# EAGLE design BLDC&PMSM (EAGLE 7.6.0)
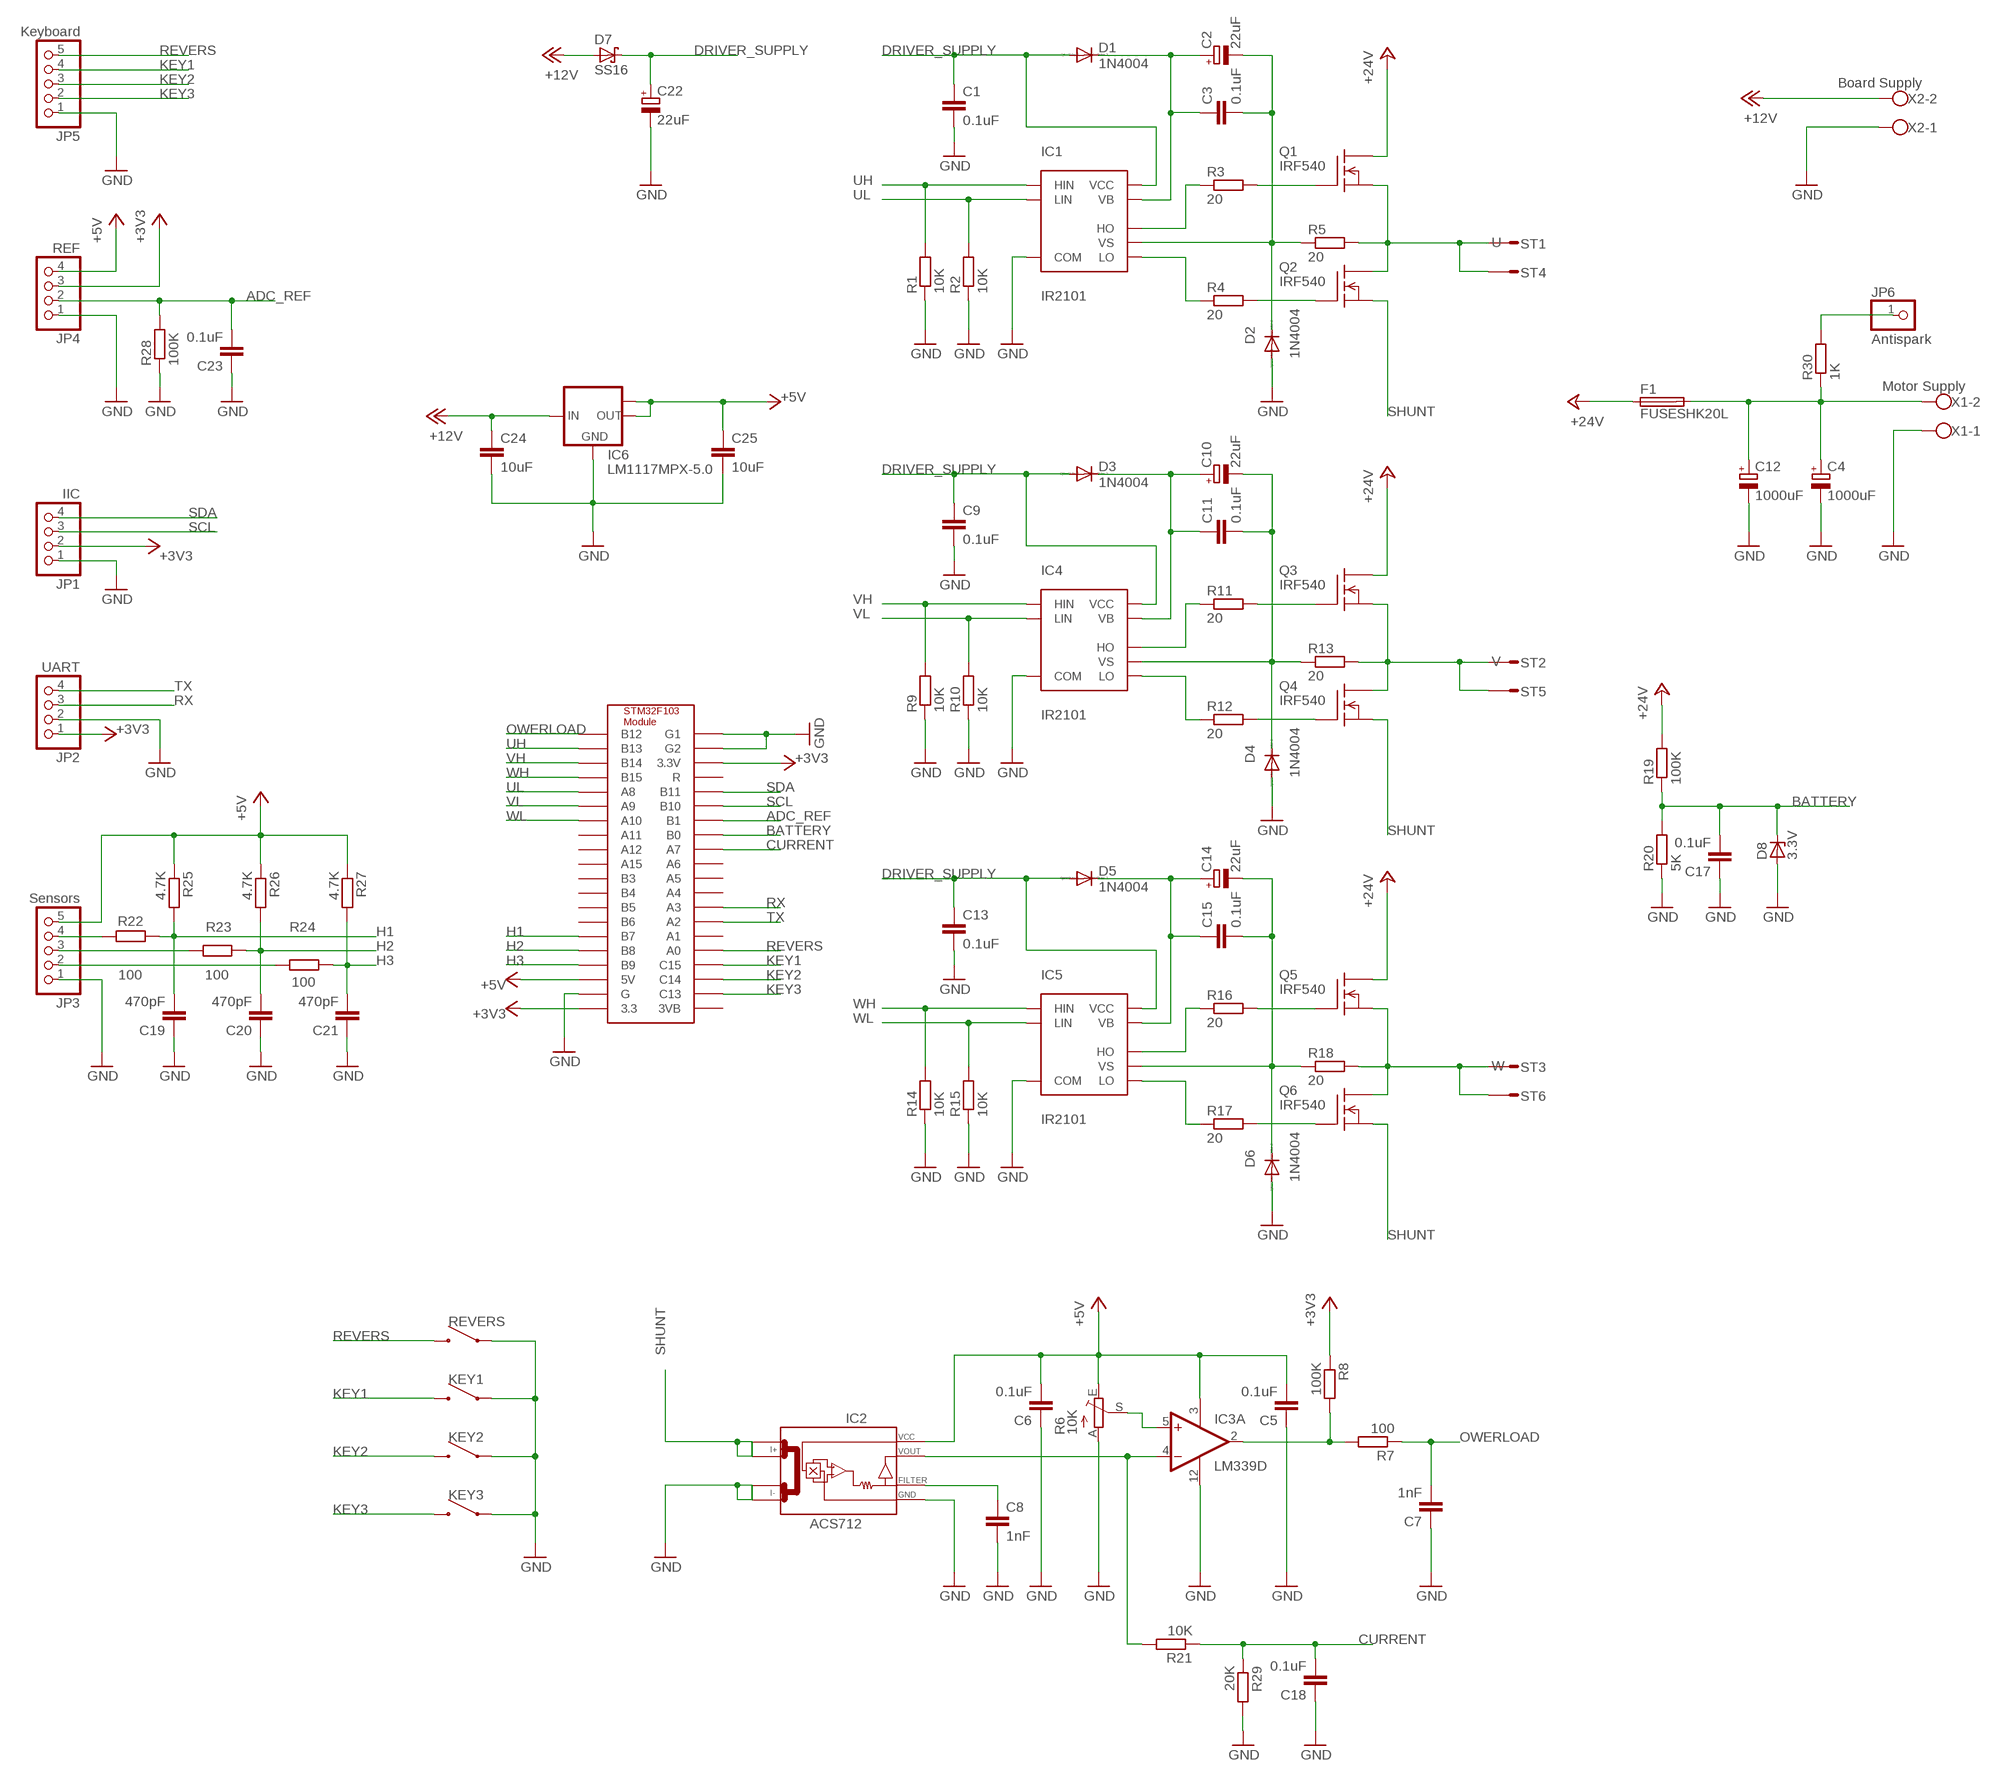
[diagram p0: schematic, sheet 1]

## Parts
C1  0.1uF  C-EUC0805K  [C0805K]
C2  22uF  CPOL-EUE2-5  [E2-5]
C3  0.1uF  C-EUC0805K  [C0805K]
C4  1000uF  CPOL-EUE5-13  [E5-13]
C5  0.1uF  C-EUC0805K  [C0805K]
C6  0.1uF  C-EUC0805K  [C0805K]
C7  1nF  C-EUC0805K  [C0805K]
C8  1nF  C-EUC0805K  [C0805K]
C9  0.1uF  C-EUC0805K  [C0805K]
C10  22uF  CPOL-EUE2-5  [E2-5]
C11  0.1uF  C-EUC0805K  [C0805K]
C12  1000uF  CPOL-EUE5-13  [E5-13]
C13  0.1uF  C-EUC0805K  [C0805K]
C14  22uF  CPOL-EUE2-5  [E2-5]
C15  0.1uF  C-EUC0805K  [C0805K]
C17  0.1uF  C-EUC0805K  [C0805K]
C18  0.1uF  C-EUC0805K  [C0805K]
C19  470pF  C-EUC0805K  [C0805K]
C20  470pF  C-EUC0805K  [C0805K]
C21  470pF  C-EUC0805K  [C0805K]
C22  22uF  CPOL-EUE2-5  [E2-5]
C23  0.1uF  C-EUC0805K  [C0805K]
C24  10uF  C-EUC0805K  [C0805K]
C25  10uF  C-EUC1206K  [C1206K]
D1  1N4004  [DO41-10]
D2  1N4004  [DO41-10]
D3  1N4004  [DO41-10]
D4  1N4004  [DO41-10]
D5  1N4004  [DO41-10]
D6  1N4004  [DO41-10]
D7  SS16  SCHOTTKY-DIODESMD  [SMB]
D8  3.3V  ZENER-DIODESMB  [SMB]
F1  FUSESHK20L  [SHK20L]
IC1  IR2101  IR2101S  [SO08]
IC2  ACS712  [SO08]
IC3  LM339D  [SO14]
IC4  IR2101  IR2101S  [SO08]
IC5  IR2101  IR2101S  [SO08]
IC6  LM1117MPX-5.0  [SOT223]
JP1  IIC  PINHD-1X4  [1X04]
JP2  UART  PINHD-1X4  [1X04]
JP3  Sensors  PINHD-1X5  [1X05]
JP4  REF  PINHD-1X4  [1X04]
JP5  Keyboard  PINHD-1X5  [1X05]
JP6  Antispark  PINHD-1X1  [1X01]
KEY1  SWITCH  [SWITCH]
KEY2  SWITCH  [SWITCH]
KEY3  SWITCH  [SWITCH]
Q1  IRF540  [TO220]
Q2  IRF540  [TO220]
Q3  IRF540  [TO220]
Q4  IRF540  [TO220]
Q5  IRF540  [TO220]
Q6  IRF540  [TO220]
R1  10K  R-EU_M0805  [M0805]
R2  10K  R-EU_M0805  [M0805]
R3  20  R-EU_M0805  [M0805]
R4  20  R-EU_M0805  [M0805]
R5  20  R-EU_M0805  [M0805]
R6  10K  TRIM_EU-CA6V  [CA6V]
R7  100  R-EU_M0805  [M0805]
R8  100K  R-EU_M0805  [M0805]
R9  10K  R-EU_M0805  [M0805]
R10  10K  R-EU_M0805  [M0805]
R11  20  R-EU_M0805  [M0805]
R12  20  R-EU_M0805  [M0805]
R13  20  R-EU_M0805  [M0805]
R14  10K  R-EU_M0805  [M0805]
R15  10K  R-EU_M0805  [M0805]
R16  20  R-EU_M0805  [M0805]
R17  20  R-EU_M0805  [M0805]
R18  20  R-EU_M0805  [M0805]
R19  100K  R-EU_M0805  [M0805]
R20  5K  R-EU_M0805  [M0805]
R21  10K  R-EU_M0805  [M0805]
R22  100  R-EU_M0805  [M0805]
R23  100  R-EU_M0805  [M0805]
R24  100  R-EU_M0805  [M0805]
R25  4.7K  R-EU_M0805  [M0805]
R26  4.7K  R-EU_M0805  [M0805]
R27  4.7K  R-EU_M0805  [M0805]
R28  100K  R-EU_M0805  [M0805]
R29  20K  R-EU_M0805  [M0805]
R30  1K  R-EU_M0805  [M0805]
REVERS  SWITCH  [SWITCH]
ST1  ST2,8  [ST2,8]
ST2  ST2,8  [ST2,8]
ST3  ST2,8  [ST2,8]
ST4  ST2,8  [ST2,8]
ST5  ST2,8  [ST2,8]
ST6  ST2,8  [ST2,8]
U$1  STM32F103MODULE  [STM32F103MODULE]
X1  Motor Supply  W237-102  [W237-102]
X2  Board Supply  W237-102  [W237-102]

## Nets
+3V3: JP1.2 JP2.1 JP4.3 R8.1 U$1.P$20(3.3) U$1.P$23(3.3V)
+5V: C5.2 C6.2 C25.1 IC2.8(VCC) IC3.3(P:V+) IC6.2(OUT) IC6.TAB(OUT1) JP3.5 JP4.4 R6.E R25.1 R26.1 R27.1 U$1.P$18(5V)
+12V: C24.1 D7.A IC6.3(IN) X2.2
+24V: F1.1A Q1.2(D) Q3.2(D) Q5.2(D) R19.2
ADC_REF: C23.2 JP4.2 R28.2 U$1.P$27(B1)
BATTERY: C17.2 D8.C R19.1 R20.2 U$1.P$28(B0)
CURRENT: C18.2 R21.1 R29.1 U$1.P$29(A7)
DRIVER_SUPPLY: C1.1 C9.1 C13.1 C22.+ D1.A D3.A D5.A D7.C IC1.1(VCC) IC4.1(VCC) IC5.1(VCC)
GND: C1.2 C4.- C5.1 C6.1 C7.1 C8.2 C9.2 C12.- C13.2 C17.1 C18.1 C19.1 C20.1 C21.1 C22.- C23.1 C24.2 C25.2 D2.A D4.A D6.A D8.A IC1.4(COM) IC2.3(I-_0) IC2.4(I-_1) IC2.5(GND) IC3.12(P:GND) IC4.4(COM) IC5.4(COM) IC6.1(GND) JP1.1 JP2.2 JP3.1 JP4.1 JP5.1 KEY1.P$2 KEY2.P$2 KEY3.P$2 R1.1 R2.1 R6.A R9.1 R10.1 R14.1 R15.1 R20.1 R28.1 R29.2 REVERS.P$2 U$1.P$19(G) U$1.P$21(G1) U$1.P$22(G2) X1.1 X2.1
H1: C19.2 R22.1 R25.2 U$1.P$15(B7)
H2: C20.2 R23.1 R26.2 U$1.P$16(B8)
H3: C21.2 R24.1 R27.2 U$1.P$17(B9)
KEY1: JP5.4 KEY1.P$1 U$1.P$37(C15)
KEY2: JP5.3 KEY2.P$1 U$1.P$38(C14)
KEY3: JP5.2 KEY3.P$1 U$1.P$39(C13)
N$1: IC3.5(A:+IN) R6.S
N$2: JP3.4 R22.2
N$3: IC2.7(VOUT) IC3.4(A:-IN) R21.2
N$4: IC3.2(A:OUT) R7.2 R8.2
N$5: Q1.1(G) R3.2
N$6: Q2.1(G) R4.2
N$7: IC1.7(HO) R3.1
N$8: IC1.5(LO) R4.1
N$9: C2.- C3.2 D2.C IC1.6(VS) R5.1
N$10: C2.+ C3.1 D1.C IC1.8(VB)
N$11: C8.1 IC2.6(FILTER)
N$12: Q3.1(G) R11.2
N$13: Q4.1(G) R12.2
N$14: IC4.7(HO) R11.1
N$15: IC4.5(LO) R12.1
N$16: C10.- C11.2 D4.C IC4.6(VS) R13.1
N$17: C10.+ C11.1 D3.C IC4.8(VB)
N$18: JP3.3 R23.2
N$19: Q5.1(G) R16.2
N$20: Q6.1(G) R17.2
N$21: IC5.7(HO) R16.1
N$22: IC5.5(LO) R17.1
N$23: C14.- C15.2 D6.C IC5.6(VS) R18.1
N$24: C14.+ C15.1 D5.C IC5.8(VB)
N$25: JP3.2 R24.2
N$26: C4.+ C12.+ F1.2A R30.1 X1.2
N$27: JP6.1 R30.2
OWERLOAD: C7.2 R7.1 U$1.P$1(B12)
REVERS: JP5.5 REVERS.P$1 U$1.P$36(A0)
RX: JP2.3 U$1.P$33(A3)
SCL: JP1.3 U$1.P$26(B10)
SDA: JP1.4 U$1.P$25(B11)
SHUNT: IC2.1(I+_0) IC2.2(I+_1) Q2.3(S) Q4.3(S) Q6.3(S)
TX: JP2.4 U$1.P$34(A2)
U: Q1.3(S) Q2.2(D) R5.2 ST1.1(ST) ST4.1(ST)
UH: IC1.2(HIN) R1.2 U$1.P$2(B13)
UL: IC1.3(LIN) R2.2 U$1.P$5(A8)
V: Q3.3(S) Q4.2(D) R13.2 ST2.1(ST) ST5.1(ST)
VH: IC4.2(HIN) R9.2 U$1.P$3(B14)
VL: IC4.3(LIN) R10.2 U$1.P$6(A9)
W: Q5.3(S) Q6.2(D) R18.2 ST3.1(ST) ST6.1(ST)
WH: IC5.2(HIN) R14.2 U$1.P$4(B15)
WL: IC5.3(LIN) R15.2 U$1.P$7(A10)
Unconnected: IC3.1(B:OUT) IC3.6(B:-IN) IC3.7(B:+IN) IC3.8(C:-IN) IC3.9(C:+IN) IC3.10(D:-IN) IC3.11(D:+IN) IC3.13(D:OUT) IC3.14(C:OUT) U$1.P$8(A11) U$1.P$9(A12) U$1.P$10(A15) U$1.P$11(B3) U$1.P$12(B4) U$1.P$13(B5) U$1.P$14(B6) U$1.P$24(R) U$1.P$30(A6) U$1.P$31(A5) U$1.P$32(A4) U$1.P$35(A1)

## Power pins joined to a net without a drawn wire
3VB: U$1.P$40(3VB)

## Library data of the parts
C1 C3 C5-C9 C11 C13 C15 C17-C21 C23-C25 = resistor:C-EU: CAPACITOR, European symbol
C2 C4 C10 C12 C14 C22 = resistor:CPOL-EU: POLARIZED CAPACITOR, European symbol
D1-D6 = diode:1N4004: DIODE general purpose rectifier, 1 A
D7 = diode:SCHOTTKY-DIODE: Schottky Diode
D8 = diode:ZENER-DIODE: Z-Diode
F1 = fuse:FUSE: Fuse; OC_FARNELL: unknown; OC_NEWARK: unknown
IC1 IC4 IC5 = m_ic-power:IR2101S: HIGH AND LOW SIDE DRIVER Features • Floating channel designed for bootstrap operation Fully operational to +600V, Tolerant to negative transient voltage, dV/dt immune • Gate drive supply range from 10 to 20V • Undervoltage lockout • 3.3V, 5V, and 15V logic input compatible • Matched propagation delay for both channels • Outputs in phase with inputs (IR2101) or out of phase with inputs (IR2102) Product Summary VOFFSET 600V max. IO+/- 130 mA / 270 mA VOUT 10 - 20V ton/off (typ.) 160 & 150 ns Delay Matching 50 ns Description The IR2101(S)/IR2102(S) are high voltage, high speed power MOSFET and IGBT drivers with independent high and low side referenced output channels. Proprietary HVIC and latch immune CMOS technologies enable ruggedized monolithic construction. The logic input is compatible with standard CMOS or LSTTL output, down to 3.3V logic. The output drivers feature a high pulse current buffer stage designed for minimum driver cross-conduction. The floating channel can be used to drive an N-channel power MOSFET or IGBT in the high side configuration which operates up to 600 volts. Packages 8-Lead SOIC IR2101S/IR2102S 8-Lead PDIP IR2101/IR2102
IC2 = ACS712:ACS712
IC3 = linear:LM339: Low Power Low Offset Voltage Quad Comparators with open collector; LM139/LM239/LM339/LM2901/LM3302
IC6 = lm1117:LM1117MPX-*
JP1 JP2 JP4 = pinhead:PINHD-1X4: PIN HEADER
JP3 JP5 = pinhead:PINHD-1X5: PIN HEADER
JP6 = pinhead:PINHD-1X1: PIN HEADER
KEY1-KEY3 REVERS = my:SWITCH
Q1-Q6 = transistor-fet:IRF540: N-Channel Enhancement MOSFET (HEXFET); 100V; 28A; 0,077Ohm
R1-R5 R7-R30 = resistor:R-EU_: RESISTOR, European symbol
R6 = pot:TRIM_EU-: POTENTIOMETER
ST1-ST6 = con-rib:ST2,8: RIBBON CABLE CONNECTOR Flachstecker / Faston; OC_FARNELL: unknown; OC_NEWARK: unknown
U$1 = Modules_bold_edition:STM32F103MODULE
X1 X2 = con-wago-500:W237-102: WAGO SCREW CLAMP; MPN: 237-102; OC_FARNELL: unknown; OC_NEWARK: 70K9898

## Board
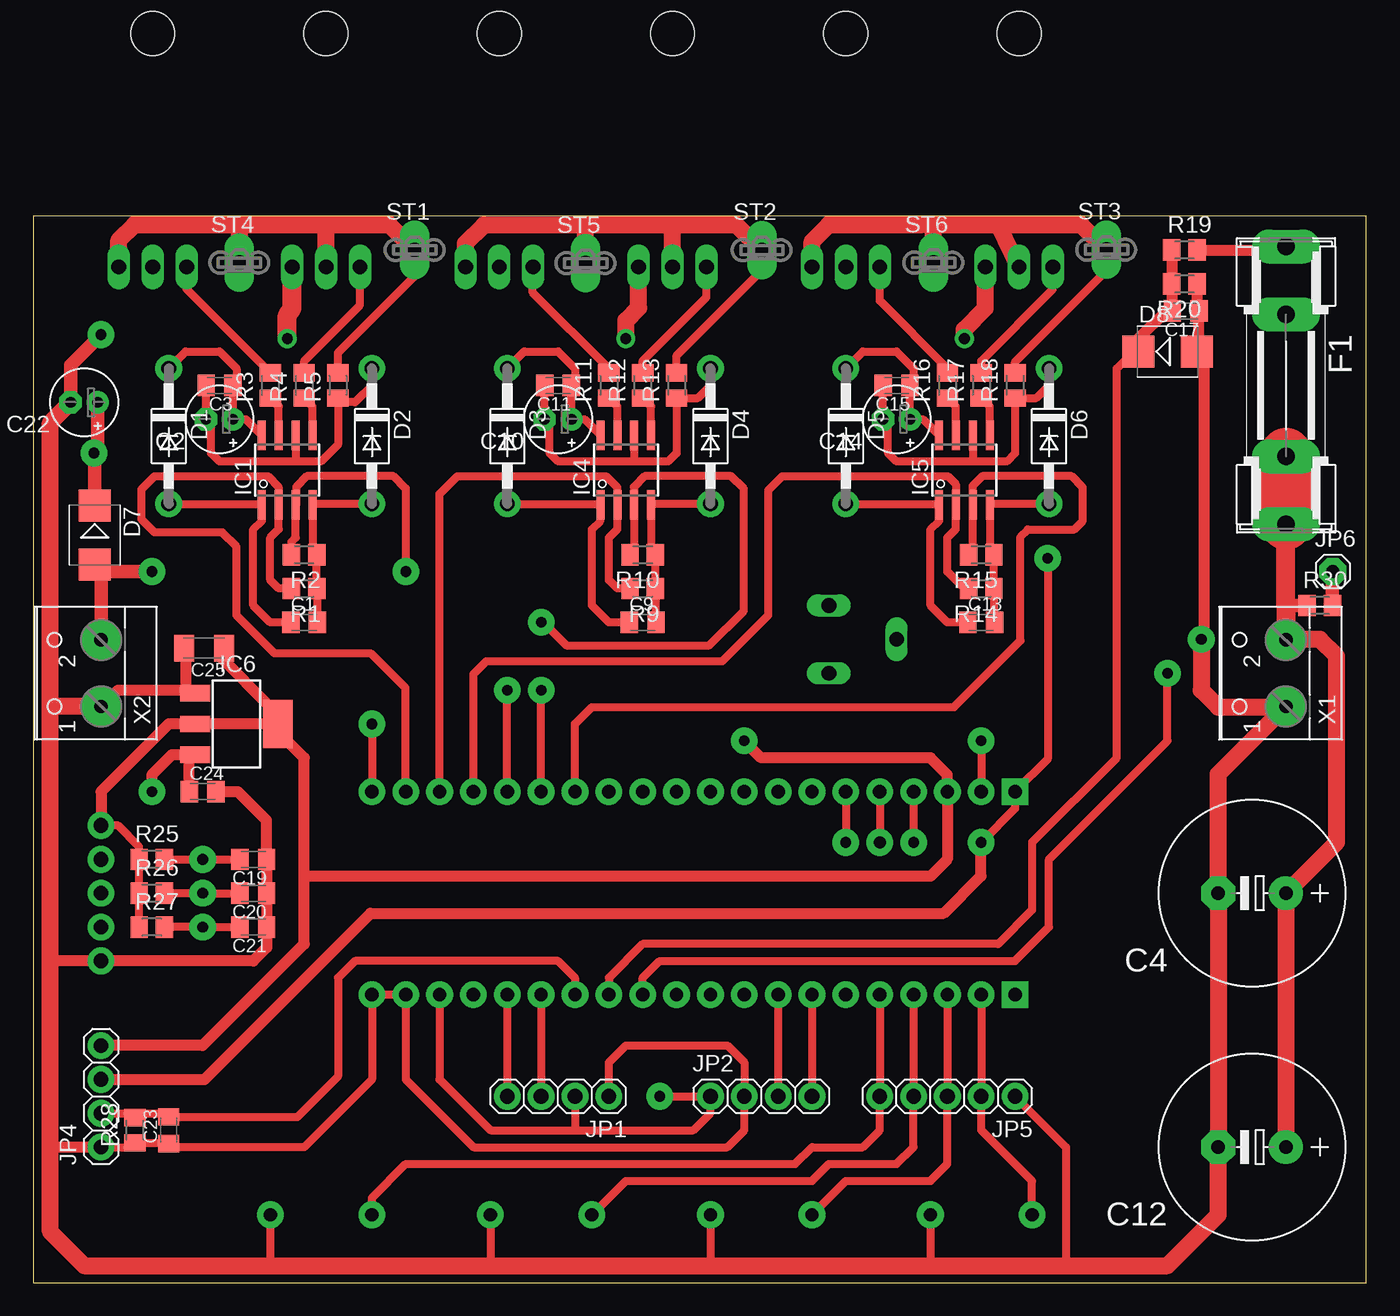
[diagram p1: board, top side]
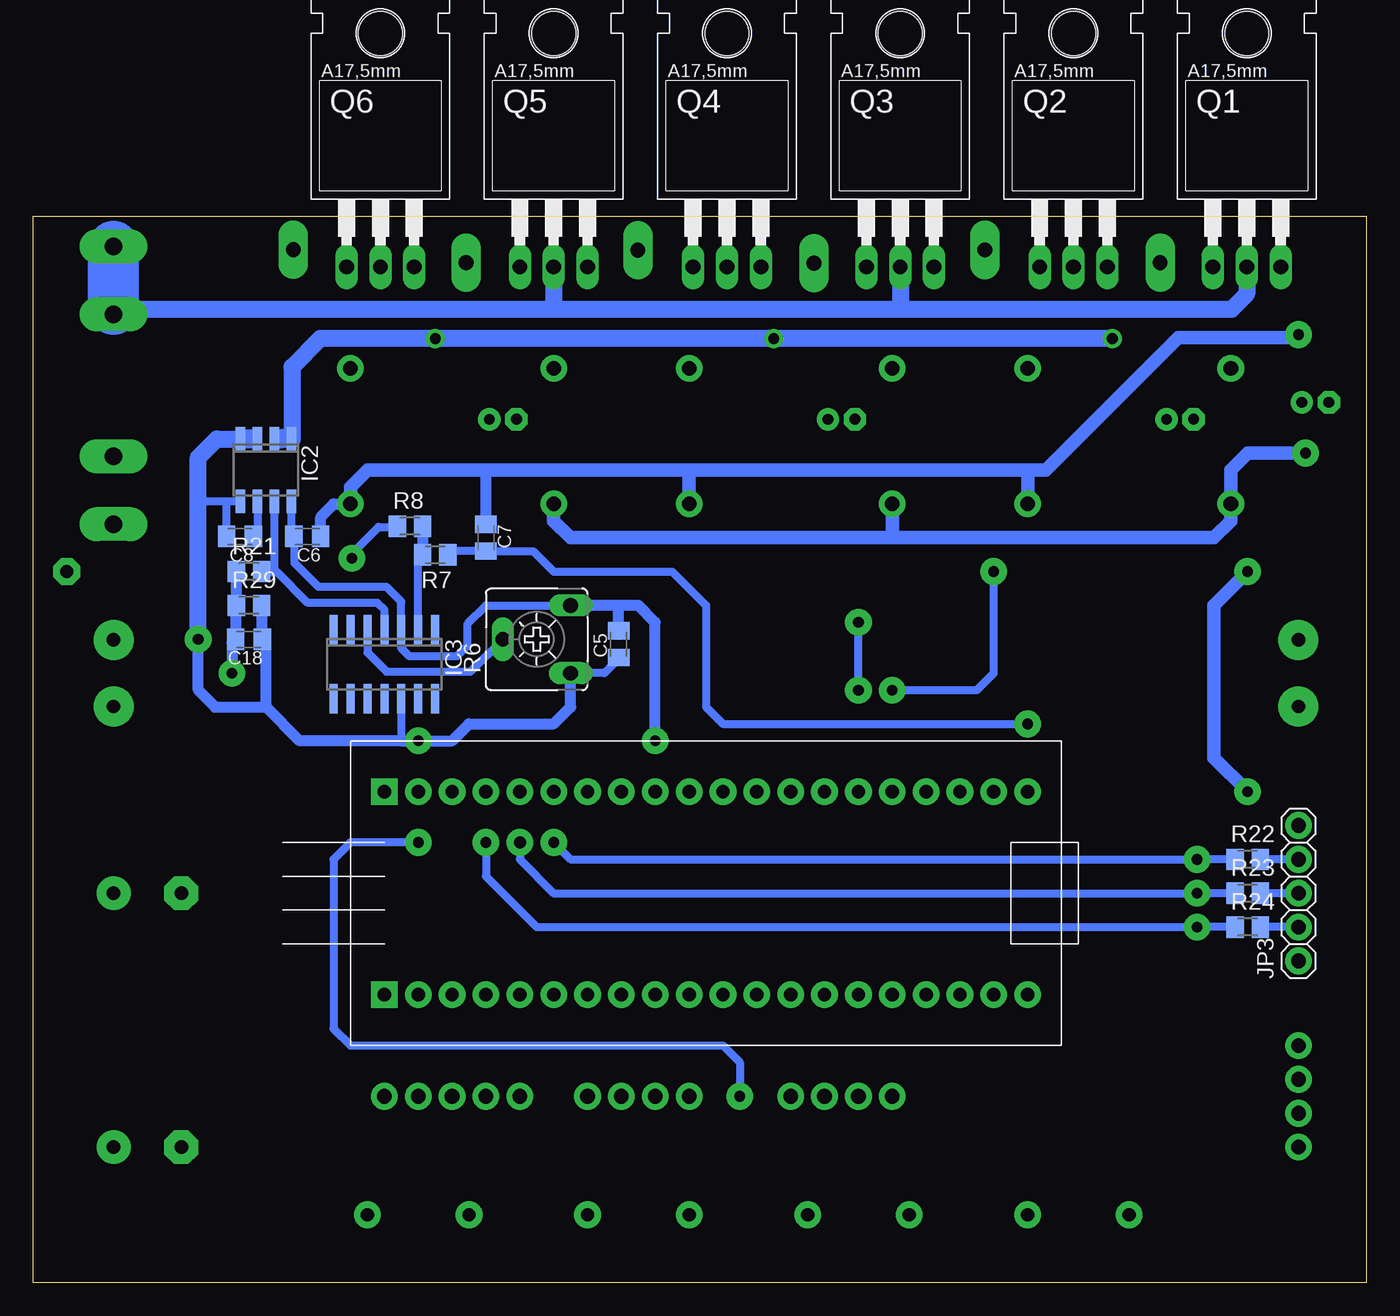
[diagram p2: board, bottom side, seen from below]

Size 100 x 80 mm. Coordinates in mm from the lower left corner, seen from the top.
Outline: 0,0 100,0 100,80 0,80 0,0
Copper layers (1*16): Top 0.035mm / dielectric 1.5mm / Bottom 0.035mm
Design rules "default *": minimum track width 10mil, minimum drill 24mil, track to track 8mil, track to pad 8mil, pad to pad 8mil, via to via 8mil, smd to smd 8mil, copper to edge 4mil, drill to drill 8mil, minimum pad ring 10mil, minimum via ring 8mil, stop-mask expansion 4mil, vias tented up to drill 0mil, thermal gap 10mil

### Footprints (pad centres in the part's own frame; a part is rotated, then mirrored left to right if it is on the bottom)
C0805K = smd 1.3 x 1.6: 1 -1,0; 2 1,0
E2-5 = drill 0.8 pad 1.676: + -1.016,0 | drill 0.813 pad 1.676 octagon: - 1.016,0
E5-13 = drill 1.016 pad 2.54: + -2.54,0 | drill 1.016 pad 2.54 octagon: - 2.54,0
C1206K = smd 1.5 x 2: 1 -1.5,0; 2 1.5,0
DO41-10 = drill 1.1 pad 2: A 5.08,0; C -5.08,0
SMB = smd 2.4 x 2.4: A 2.2,0; C -2.2,0
SHK20L = drill 1.321 pad 2.54 long: 1A -10.414,0; 1B -5.334,0; 2A 10.414,0; 2B 5.334,0
SO08 = smd 2.2 x 0.6: 1 -2.604,1.905; 2 -2.604,0.635; 3 -2.604,-0.635; 4 -2.604,-1.905; 5 2.604,-1.905; 6 2.604,-0.635; 7 2.604,0.635; 8 2.604,1.905
SO08' = smd 0.72 x 1.78: 1 -1.905,-2.35; 2 -0.635,-2.35; 3 0.635,-2.35; 4 1.905,-2.35; 5 1.905,2.35; 6 0.635,2.35; 7 -0.635,2.35; 8 -1.905,2.35
SO14 = smd 0.6 x 2.2: 1 -3.81,-2.6; 2 -2.54,-2.6; 3 -1.27,-2.6; 4 0,-2.6; 5 1.27,-2.6; 6 2.54,-2.6; 7 3.81,-2.6; 8 3.81,2.6; 9 2.54,2.6; 10 1.27,2.6; 11 0,2.6; 12 -1.27,2.6; 13 -2.54,2.6; 14 -3.81,2.6
SOT223 = smd 1.219 x 2.235: 1 -2.311,-3.099; 2 0,-3.099; 3 2.311,-3.099 | smd 3.6 x 2.2: TAB 0,3.099
1X04 = drill 1.1 pad 2: 1 -3.81,0; 2 -1.27,0; 3 1.27,0; 4 3.81,0
1X05 = drill 1.1 pad 2: 1 -5.08,0; 2 -2.54,0; 3 0,0; 4 2.54,0; 5 5.08,0
1X01 = drill 1 pad 2 octagon: 1 0,0
SWITCH = drill 1 pad 2: P$1 0,-3.81; P$2 0,3.81
TO220 = drill 1.118 long: 1 -2.54,-6.35; 2 0,-6.35; 3 2.54,-6.35 | hole 3.302: 0,11.176
M0805 = smd 1.3 x 1.6: 1 -0.95,0; 2 0.95,0
CA6V = drill 1.1 long: A -2.54,-2.54; E 2.54,-2.54; S 0,2.54
ST2,8 = drill 1.1 pad 2.2 long: 1 0,0
STM32F103MODULE = drill 1 pad 2: P$1 -7.62,22.86; P$2 -7.62,20.32; P$3 -7.62,17.78; P$4 -7.62,15.24; P$5 -7.62,12.7; P$6 -7.62,10.16; P$7 -7.62,7.62; P$8 -7.62,5.08; P$9 -7.62,2.54; P$10 -7.62,0; P$11 -7.62,-2.54; P$12 -7.62,-5.08; P$13 -7.62,-7.62; P$14 -7.62,-10.16; P$15 -7.62,-12.7; P$16 -7.62,-15.24; P$17 -7.62,-17.78; P$18 -7.62,-20.32; P$19 -7.62,-22.86; P$21 7.62,22.86; P$22 7.62,20.32; P$23 7.62,17.78; P$24 7.62,15.24; P$25 7.62,12.7; P$26 7.62,10.16; P$27 7.62,7.62; P$28 7.62,5.08; P$29 7.62,2.54; P$30 7.62,0; P$31 7.62,-2.54; P$32 7.62,-5.08; P$33 7.62,-7.62; P$34 7.62,-10.16; P$35 7.62,-12.7; P$36 7.62,-15.24; P$37 7.62,-17.78; P$38 7.62,-20.32; P$39 7.62,-22.86 | drill 1 pad 2 square: P$20 -7.62,-25.4; P$40 7.62,-25.4
W237-102 = drill 1 pad 3: 1 -2.5,-1.27; 2 2.5,-1.27

### Placement (x,y rotation side)
C1  20.32,49.53 0 top
C2  13.97,64.77 180 top
C3  13.97,67.31 180 top
C4  91.44,29.21 180 top
C5  56.08,47.89 90 bottom
C6  79.44,55.98 180 bottom
C7  66.04,55.88 270 bottom
C8  84.49,55.98 180 bottom
C9  45.72,49.53 0 top
C10  39.37,64.77 180 top
C11  39.37,67.31 180 top
C12  91.44,10.16 180 top
C13  71.12,49.53 0 top
C14  64.77,64.77 180 top
C15  64.77,67.31 180 top
C17  86.46,72.89 180 top
C18  83.82,48.26 180 bottom
C19  16.51,31.75 180 top
C20  16.51,29.21 180 top
C21  16.51,26.67 180 top
C22  3.81,66.04 180 top
C23  10.16,11.43 90 top
C24  12.7,36.83 0 top
C25  12.8,47.59 180 top
D1  10.16,63.5 270 top
D2  25.4,63.5 270 top
D3  35.56,63.5 270 top
D4  50.8,63.5 270 top
D5  60.96,63.5 270 top
D6  76.2,63.5 270 top
D7  4.61,56.08 270 top
D8  85.09,69.85 0 top
F1  93.98,67.31 270 top
IC1  19.05,60.96 90 top
IC2  ACS712  [SO08']  82.55,60.96 180 bottom
IC3  73.66,46.39 180 bottom
IC4  44.45,60.96 90 top
IC5  69.85,60.96 90 top
IC6  15.24,41.91 270 top
JP1  39.37,13.97 180 top
JP2  54.61,13.97 0 top
JP3  5.08,29.21 90 bottom
JP4  5.08,13.97 90 top
JP5  68.58,13.97 180 top
JP6  97.49,53.34 0 top
KEY1  38.1,5.08 90 top
KEY2  54.61,5.08 90 top
KEY3  71.12,5.08 90 top
Q1  8.96,82.55 0 bottom
Q2  21.96,82.55 0 bottom
Q3  34.96,82.55 0 bottom
Q4  47.96,82.55 0 bottom
Q5  60.96,82.55 0 bottom
Q6  73.96,82.55 0 bottom
R1  20.32,52.07 180 top
R2  20.32,54.61 180 top
R3  17.78,67.31 90 top
R4  20.32,67.31 90 top
R5  22.86,67.31 90 top
R6  62.23,48.26 90 bottom
R7  69.85,54.61 180 bottom
R8  71.75,56.75 0 bottom
R9  45.72,52.07 180 top
R10  45.72,54.61 180 top
R11  43.18,67.31 90 top
R12  45.72,67.31 90 top
R13  48.26,67.31 90 top
R14  71.12,52.07 180 top
R15  71.12,54.61 180 top
R16  68.58,67.31 90 top
R17  71.12,67.31 90 top
R18  73.66,67.31 90 top
R19  86.36,77.47 0 top
R20  86.36,74.93 180 top
R21  83.82,53.34 0 bottom
R22  8.89,31.75 0 bottom
R23  8.89,29.21 0 bottom
R24  8.89,26.67 0 bottom
R25  8.89,31.75 0 top
R26  8.89,29.21 0 top
R27  8.89,26.67 0 top
R28  7.62,11.43 90 top
R29  83.82,50.8 0 bottom
R30  96.52,50.8 0 top
REVERS  21.59,5.08 90 top
ST1  28.61,77.47 0 top
ST2  54.65,77.46 0 top
ST3  80.5,77.49 0 top
ST4  15.46,76.52 0 top
ST5  41.43,76.48 0 top
ST6  67.53,76.52 0 top
U$1  48.26,29.21 270 bottom
X1  92.71,45.72 90 top
X2  3.81,45.72 90 top

### Tracks (layer width: path | path; a pad name or v marks a point on that pad's centre or on a via)
+3V3  (via drill 0.8 pad 2)
  Top 0.61: v76.1,54.33 76.1,39.27 U$1.P$20 73.66,35.56 v71.12,33.02 71.1,33 | U$1.P$23 30.48,15.24 34.29,11.43 40.64,11.43 | 40.64,11.43 49.53,11.43 50.8,12.7 JP2.1 v46.99,13.97 | JP1.2 40.64,11.43
  Top 0.813: JP4.3 12.84,15.24 25.3,27.7 68.3,27.7 71.1,30.5 71.1,33
  Bottom 0.61: v71.12,33.02 76.2,33.02 77.47,31.75 77.47,19.05 76.2,17.78 48.26,17.78 46.99,16.51 v46.99,13.97 | v76.1,54.33 76.1,54.7 74.1,56.7 72.75,56.7 R8.1
+5V  (via drill 0.8 pad 2)
  Top 0.61: R27.1 R26.1 R25.1 7.94,32.7 6.35,34.29 JP3.5 | IC6.TAB 17.78,41.91 17.78,43.18
  Top 0.813: C25.1 13.97,46.99 17.78,43.18 | JP3.5 5.08,36.83 10.16,41.91 IC6.2 17.78,41.91 20.32,39.37 20.32,30.48 | 20.32,30.48 20.32,25.4 12.7,17.78 JP4.4 | 20.32,30.48 67.31,30.48 68.58,31.75 U$1.P$18 68.58,38.1 67.31,39.37 54.61,39.37 v53.34,40.64
  Bottom 0.61: IC2.8 80.64,55.98 C6.2 80.4,55.94 80.4,54 78.6,52.2 73.5,52.2 72.39,51.09 IC3.3 72.39,47.59 71.8,47 68.2,47 67.4,47.8 67.4,49.44 66.04,50.8 R6.E | 56.08,50.6 55.88,50.8
  Bottom 0.813: v53.34,40.64 53.34,49.53 54.61,50.8 55.88,50.8 R6.E | C5.2 56.08,50.6
+12V  (via drill 0.8 pad 2)
  Top 0.61: 11.7,39.16 IC6.3
  Top 0.813: C24.1 11.7,39.16 | IC6.3 10.39,39.6 8.89,38.1 v8.89,36.83
  Top 1: X2.2 5.08,53.41 D7.A
  Top 1.016: v8.89,53.34 5.15,53.34 5.08,53.41
  Bottom 1.016: v8.89,53.34 11.43,50.8 11.43,39.37 v8.89,36.83
+24V
  Top 0.813: R19.2 93.73,77.47 F1.1A
  Bottom 1.27: 93.98,73.03 60.96,73.03 | 60.96,73.03 34.96,73.03 | 34.96,73.03 10.1,73.03 8.96,74.16 Q1.2 | Q3.2 34.96,73.03 | Q5.2 60.96,73.03
  Bottom 3.81: 93.98,73.03 F1.1A
ADC_REF
  Top 0.61: 10.11,12.38 C23.2 | U$1.P$27 40.64,22.86 39.37,24.13 24.13,24.13 22.86,22.86 22.86,15.46 19.8,12.4 10.19,12.4 C23.2 | 7.3,12.7 9.89,12.7 C23.2 | JP4.2 7.3,12.7 | 7.3,12.7 R28.2
BATTERY
  Top 0.61: U$1.P$28 43.18,22.86 45.72,25.4 72.39,25.4 74.93,27.94 74.93,33.02 81.28,39.37 81.28,68.58 82.55,69.85 D8.C 82.92,69.88 | 85.41,72.94 C17.2
  Top 0.813: R19.1 R20.2 85.41,72.94 | C17.2 84.99,72.89 82.88,70.78 D8.C
CURRENT  (via drill 0.8 pad 2)
  Top 0.61: U$1.P$29 45.72,22.86 46.99,24.13 73.66,24.13 76.2,26.67 76.2,31.75 85.09,40.64 v85.09,45.72
  Bottom 0.61: R29.1 84.82,50.75 | 85.09,47.99 C18.2
  Bottom 0.813: R21.1 R29.1 | 84.82,50.75 C18.2 | 85.09,47.99 v85.09,45.72
DRIVER_SUPPLY  (via drill 0.8 pad 2)
  Top 0.61: C1.1 17.78,49.53 16.51,50.8 16.51,56.52 17.14,57.15 IC1.1 17.08,58.42 D1.A | C9.1 43.18,49.53 41.91,50.8 41.91,56.52 42.55,57.15 IC4.1 35.62,58.36 D3.A | C13.1 68.58,49.53 67.31,50.8 67.31,56.52 67.94,57.15 IC5.1 67.88,58.42 D5.A | 4.61,62.17 v4.55,62.23 4.83,62.51
  Top 1: D7.C 4.61,62.17 | C22.+ 4.83,62.51
  Bottom 1: v4.55,62.23 8.89,62.23 10.16,60.96 D1.A 10.16,57.15 11.43,55.88 35.56,55.88 | 35.56,55.88 59.69,55.88 60.96,57.15 D5.A | D3.A 35.56,55.88
GND  (via drill 0.8 pad 2)
  Top 0.61: C1.2 21.32,52.02 R1.1 R2.1 20.95,54.92 IC1.4 20.95,58.42 D2.A | C9.2 46.72,52.02 R9.1 R10.1 46.35,54.92 IC4.4 46.35,58.42 D4.A | C13.2 72.12,52.02 R14.1 R15.1 71.75,54.92 IC5.4 71.75,58.42 D6.A | 87.8,48.43 v87.63,48.26 | X2.1 5.12,43.22 | 11.43,44.45 11.91,44.45 IC6.1 | 17.47,31.79 C19.1 | JP1.1 43.18,16.51 44.45,17.78 52.07,17.78 53.34,16.51 JP2.2 53.34,11.43 52.07,10.16 33.02,10.16 27.94,15.24 U$1.P$22 U$1.P$21 25.4,15.24 20.32,10.16 10.43,10.16 C23.1 10.11,10.48 R28.1 7.3,10.16 JP4.1 | v71.12,40.64 U$1.P$19 | KEY3.P$2 67.31,1.27 | KEY2.P$2 50.8,1.27 | KEY1.P$2 34.29,1.27 | REVERS.P$2 17.78,1.27 | JP5.1 77.47,10.16 77.47,1.27 | 87.8,69.34 D8.A 87.45,69.77 | 87.31,73.04 C17.1
  Top 0.813: C19.1 C20.1 C21.1 17.51,25.13 16.51,24.13 JP3.1 1.27,24.13 | 87.8,69.34 87.8,48.43 | C24.2 15.34,36.83 17.47,34.7 17.47,31.79 | JP4.1 1.27,10.16 | 5.12,43.22 6.35,44.45 11.43,44.45 11.43,46.99 C25.2 | R20.1 87.31,73.04 | 87.45,69.77 C17.1
  Top 1: C22.- 2.79,68.83 v5.08,71.12
  Top 1.27: v87.63,48.26 87.63,44.45 88.9,43.18 93.94,43.18 X1.1 88.9,38.14 C4.- C12.- 88.9,5.08 85.09,1.27 77.47,1.27 67.31,1.27 50.8,1.27 34.29,1.27 17.78,1.27 3.81,1.27 1.27,3.81 1.27,10.16 1.27,24.13 1.27,43.18 | 5.04,43.18 X2.1 | 5.12,43.22 1.31,43.22 1.27,43.18 | 1.27,43.18 1.27,64.52 C22.-
  Bottom 0.61: IC2.5 85.6,58.61 | 85.6,58.61 87.44,58.61 87.63,58.42 | C8.2 85.49,58.5 85.6,58.61 | 82.82,50.75 R29.2 | 65.77,57.15 C7.1 | IC3.12 72.39,40.64 | 82.55,47.99 C18.1 | C5.1 56.08,46.79 57.15,45.72 R6.A | 84.41,63.31 IC2.3
  Bottom 0.813: C6.1 78.44,57.45 77.47,58.42 D6.A | C18.1 82.82,50.75 | v87.63,48.26 87.63,44.45 86.36,43.18 82.55,43.18 | C7.1 66.04,60.96 | 82.55,43.18 80.01,40.64 72.39,40.64 v71.12,40.64 68.58,40.64 67.31,41.91 60.96,41.91 59.69,43.18 R6.A | 82.55,43.18 82.55,47.99
  Bottom 1: 26.67,60.96 50.8,60.96 | 50.8,60.96 66.04,60.96 74.93,60.96 76.2,59.69 D6.A | D4.A 50.8,60.96
  Bottom 1.016: 25.4,60.96 24.04,60.96 14.1,70.9 5.3,70.9 v5.08,71.12 | 25.4,60.96 26.67,60.96 | D2.A 25.4,60.96
  Bottom 1.27: v87.63,48.26 87.63,58.42 87.63,61.9 86.23,63.3 IC2.4 | IC2.4 84.4,63.3 84.41,63.31 | IC2.4
  Bottom 1.422: 83.7,63.3 84.4,63.3
H1  (via drill 0.8 pad 2)
  Top 0.61: C19.2 v12.7,31.75 R25.2 | U$1.P$15 v60.96,33.02
  Bottom 0.61: R25.2 v12.7,31.75 59.69,31.75 v60.96,33.02
H2  (via drill 0.8 pad 2, 0.9 pad 2)
  Top 0.61: C20.2 v12.7,29.21 R26.2 | U$1.P$16 v63.5,33.02
  Bottom 0.61: R26.2 v12.7,29.21 60.96,29.21 63.5,31.75 v63.5,33.02
H3  (via drill 0.8 pad 2)
  Top 0.61: C21.2 v12.7,26.67 R27.2 | U$1.P$17 v66.04,33.02
  Bottom 0.61: R27.2 v12.7,26.67 62.23,26.67 66.04,30.48 v66.04,33.02
KEY1
  Top 0.61: U$1.P$37 JP5.4 66.04,10.16 64.77,8.89 59.69,8.89 58.42,7.62 44.45,7.62 KEY1.P$1
KEY2
  Top 0.61: U$1.P$38 JP5.3 68.58,8.89 67.31,7.62 60.96,7.62 KEY2.P$1
KEY3
  Top 0.61: U$1.P$39 JP5.2 71.12,11.43 74.93,7.62 KEY3.P$1
N$1
  Bottom 0.61: IC3.5 74.93,47.26 73.5,45.83 67.2,45.83 R6.S
N$2
  Bottom 0.61: JP3.4 R22.2
N$3
  Bottom 0.61: 82.73,53.2 R21.2 82.83,53.3 82.1,53.3 | IC3.4 73.66,50.46 74.2,51 79.4,51 81.7,53.3 82.1,53.3 | IC2.7 81.92,53.48 82.1,53.3
N$4
  Bottom 0.61: IC3.2 71.12,54.29 R7.2
  Bottom 0.813: R8.2 R7.2
N$5
  Top 0.61: Q1.1 11.5,74.54 R3.2
N$6
  Top 0.61: R4.2 20.32,69.15 24.5,73.34 Q2.1
N$7
  Top 0.61: IC1.7 18.41,65.72 R3.1
N$8
  Top 0.61: IC1.5 20.95,65.72 R4.1
N$9
  Top 0.61: 19.68,61.59 21.59,61.59 22.86,62.87 R5.1 23.18,66.04 24.13,66.04 25.4,67.31 D2.C | 19.68,61.59 13.97,61.59 13.34,62.23 13.34,64.39 C2.- 12.95,67.29 C3.2 | IC1.6 19.68,61.59
N$10
  Top 0.61: IC1.8 15.94,64.77 C2.+ 14.99,67.29 C3.1 15.24,67.58 15.24,68.58 13.97,69.85 11.43,69.85 D1.C
N$11
  Bottom 0.61: IC2.6 83.19,56.28 C8.1
N$12
  Top 0.61: R11.2 43.18,68.58 37.47,74.28 Q3.1
N$13
  Top 0.61: R12.2 45.72,69.15 50.5,73.93 Q4.1
N$14
  Top 0.61: IC4.7 43.81,65.72 R11.1
N$15
  Top 0.61: IC4.5 46.35,65.72 R12.1
N$16
  Top 0.61: 45.09,61.59 47.62,61.59 48.26,62.23 R13.1 49.85,66.36 50.8,67.31 D4.C | 45.09,61.59 39.37,61.59 38.73,62.23 38.73,64.39 C10.- 38.35,67.29 C11.2 | IC4.6 45.09,61.59
N$17
  Top 0.61: IC4.8 41.34,64.77 C10.+ 40.39,67.29 C11.1 40.64,67.58 40.64,68.58 39.37,69.85 36.83,69.85 D3.C
N$18
  Bottom 0.61: JP3.3 R23.2
N$19
  Top 0.61: R16.2 68.58,68.58 63.5,73.66 Q5.1
N$20
  Top 0.61: R17.2 71.12,69.15 76.49,74.52 Q6.1
N$21
  Top 0.61: IC5.7 69.22,65.72 R16.1
N$22
  Top 0.61: IC5.5 71.75,65.72 R17.1
N$23
  Top 0.61: 70.48,61.59 73.03,61.59 73.66,62.23 R18.1 75.25,66.36 76.2,67.31 D6.C | 70.48,61.59 64.77,61.59 64.14,62.23 64.14,64.39 C14.- 63.75,67.29 C15.2 | IC5.6 70.48,61.59
N$24
  Top 0.61: IC5.8 66.74,64.77 C14.+ 65.79,67.29 C15.1 66.04,67.58 66.04,68.58 64.77,69.85 62.23,69.85 D5.C
N$25
  Bottom 0.61: JP3.2 R24.2
N$26
  Top 0.61: 94.34,48.58 X1.2
  Top 1.016: R30.1 93.98,50.8
  Top 1.27: X1.2 94.02,48.26 96.52,48.26 97.79,46.99 97.79,33.02 C4.+ C12.+
  Top 1.422: X1.2 93.98,50.8 F1.2A
  Top 3.81: 93.98,62.23 F1.2A
N$27
  Top 0.61: 97.47,53.32 JP6.1
  Top 1: R30.2 97.47,53.32
OWERLOAD  (via drill 0.8 pad 2)
  Top 0.61: v25.4,41.91 U$1.P$1
  Bottom 0.61: R7.1 68.63,54.88 C7.2 62.5,54.88 60.96,53.34 52.07,53.34 49.53,50.8 49.53,43.18 48.26,41.91 v25.4,41.91
REVERS
  Top 0.61: U$1.P$36 JP5.5 63.5,11.43 62.23,10.16 58.42,10.16 57.15,8.89 27.94,8.89 25.4,6.35 REVERS.P$1
RX
  Top 0.61: U$1.P$33 JP2.3
SCL
  Top 0.61: U$1.P$26 JP1.3
SDA
  Top 0.61: U$1.P$25 JP1.4
SHUNT  (via drill 0.8 pad 1.42)
  Top 1.27: v44.45,70.82 44.45,72.17 45.41,73.13 Q4.3 | v69.85,70.82 69.85,71.51 71.43,73.09 Q6.3
  Top 1.422: v19.05,70.82 19.05,72.58 19.4,73.07 19.4,76.18 Q2.3
  Bottom 0.61: 81.4,63.31 IC2.2
  Bottom 1.27: v19.05,70.82 v44.45,70.82 v69.85,70.82 78.48,70.82 80.6,68.7 80.6,63.35 IC2.1
  Bottom 1.422: IC2.1 81.4,63.31
TX
  Top 0.61: U$1.P$34 JP2.4
U
  Top 0.61: R5.2 22.86,69.76 28.6,75.5 ST1.1
  Top 1.27: Q1.3 6.42,78.2 7.59,79.38 15.9,79.38 | 15.9,79.38 21.59,79.38 | 21.59,79.38 26.7,79.38 ST1.1 | ST4.1 15.47,79.34 15.9,79.38 | Q2.2 21.96,79 21.59,79.38
UH
  Top 0.406: 18.4,58.37 IC1.2 | 27.9,36.87 U$1.P$2
  Top 0.61: R1.2 18.41,52.07 17.78,52.7 17.78,55.88 18.41,56.52 IC1.2 | 18.4,58.37 18.4,59.7 17.6,60.5 9.1,60.5 8.12,59.52 8.12,57.25 9.09,56.28 14.17,56.28 15.24,55.21 15.24,50.06 18.07,47.23 25.3,47.23 27.9,44.63 27.9,36.87
UL  (via drill 0.8 pad 2)
  Top 0.406: 19.72,58.39 IC1.3
  Top 0.61: R2.2 19.37,55.56 19.68,55.88 IC1.3 | v27.94,53.34 27.94,59.58 27.02,60.5 20.52,60.5 19.72,59.7 19.72,58.39 | U$1.P$5 v35.56,44.45
  Bottom 0.61: v35.56,44.45 29.21,44.45 27.94,45.72 v27.94,53.34
V
  Top 0.61: R13.2 48.26,69.56 54.2,75.5 54.2,77.54 ST2.1
  Top 1.27: Q3.3 32.43,77.97 33.8,79.34 41.6,79.38 | 41.6,79.38 47.94,79.38 | Q4.2 47.94,79.38 | 47.94,79.38 52.73,79.38 ST2.1 | ST5.1 41.43,79.2 41.6,79.38
VH
  Top 0.61: R9.2 43.81,52.07 43.18,52.7 43.18,55.88 43.81,56.52 IC4.2 43.81,59.65 42.96,60.5 31.82,60.5 30.48,59.16 U$1.P$3
VL  (via drill 0.8 pad 2)
  Top 0.406: 45.06,57.83 45.09,57.8
  Top 0.61: IC4.3 45.09,57.8 45.09,54.92 R10.2 | 45.06,57.83 45.06,59.7 45.86,60.5 52.36,60.5 53.3,59.56 53.3,50.4 50.7,47.8 40,47.8 38.27,49.53 v38.1,49.53 | U$1.P$6 v38.1,44.45
  Bottom 0.61: v38.1,44.45 v38.1,49.53
W
  Top 0.61: R18.2 73.65,69.06 80.34,75.76 80.48,75.95 ST3.1
  Top 1.27: Q5.3 58.42,78.11 59.69,79.38 66.7,79.38 67.53,79.38 | 67.53,79.38 72.39,79.38 | Q6.2 72.39,79.38 | 72.39,79.38 78.59,79.38 ST3.1 | ST6.1 67.53,79.38
WH
  Top 0.406: 69.2,58.37 IC5.2
  Top 0.61: R14.2 69.85,52.07 68.58,53.34 68.58,55.88 69.22,56.52 IC5.2 | U$1.P$4 33.02,45.65 33.99,46.62 51.7,46.62 55.15,50.07 55.15,59.45 56.2,60.5 68.6,60.5 69.2,59.9 69.2,58.37
WL
  Top 0.61: U$1.P$7 40.64,41.91 41.91,43.18 69.08,43.18 74.06,48.16 74.06,55.96 74.6,56.5 78.09,56.5 78.74,57.15 78.74,59.66 77.9,60.5 71.2,60.5 70.48,59.78 IC5.3 70.5,58.34 70.5,55.3 70.17,54.97 R15.2